# EasyEDA Pro project ProProject_工科大_2023-11-10.epro, board driver
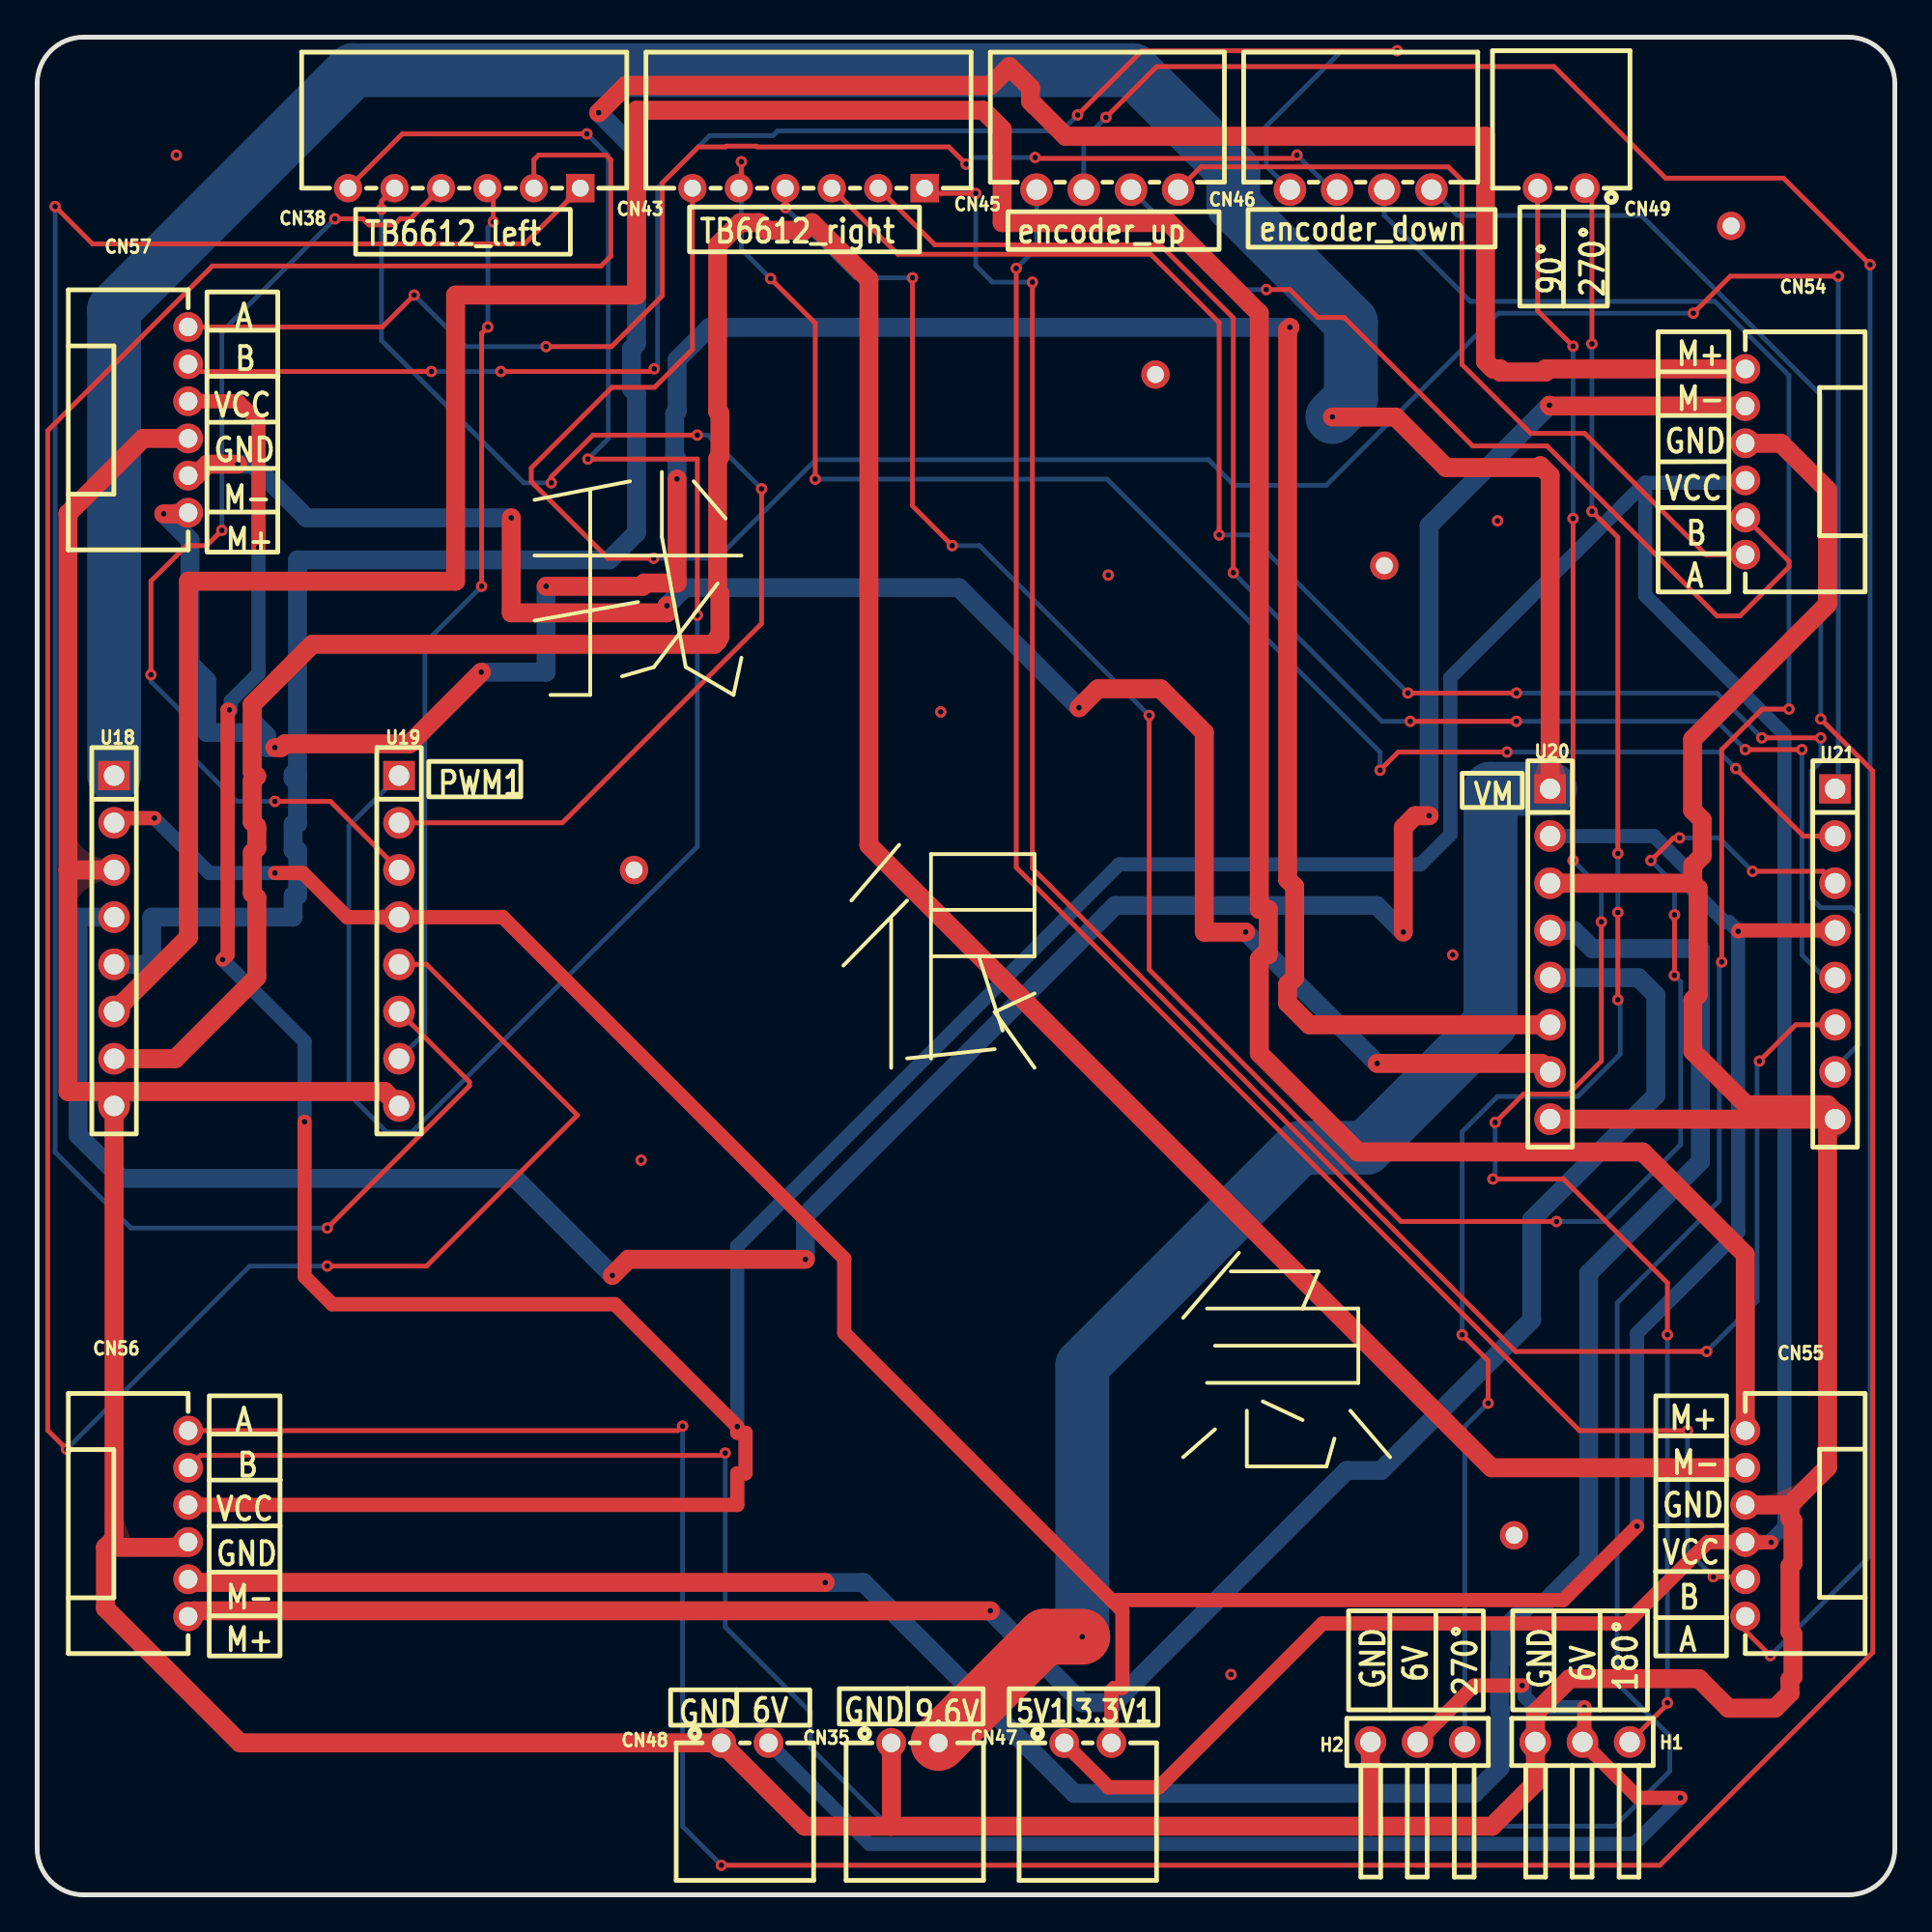
[diagram p5: board, top side]
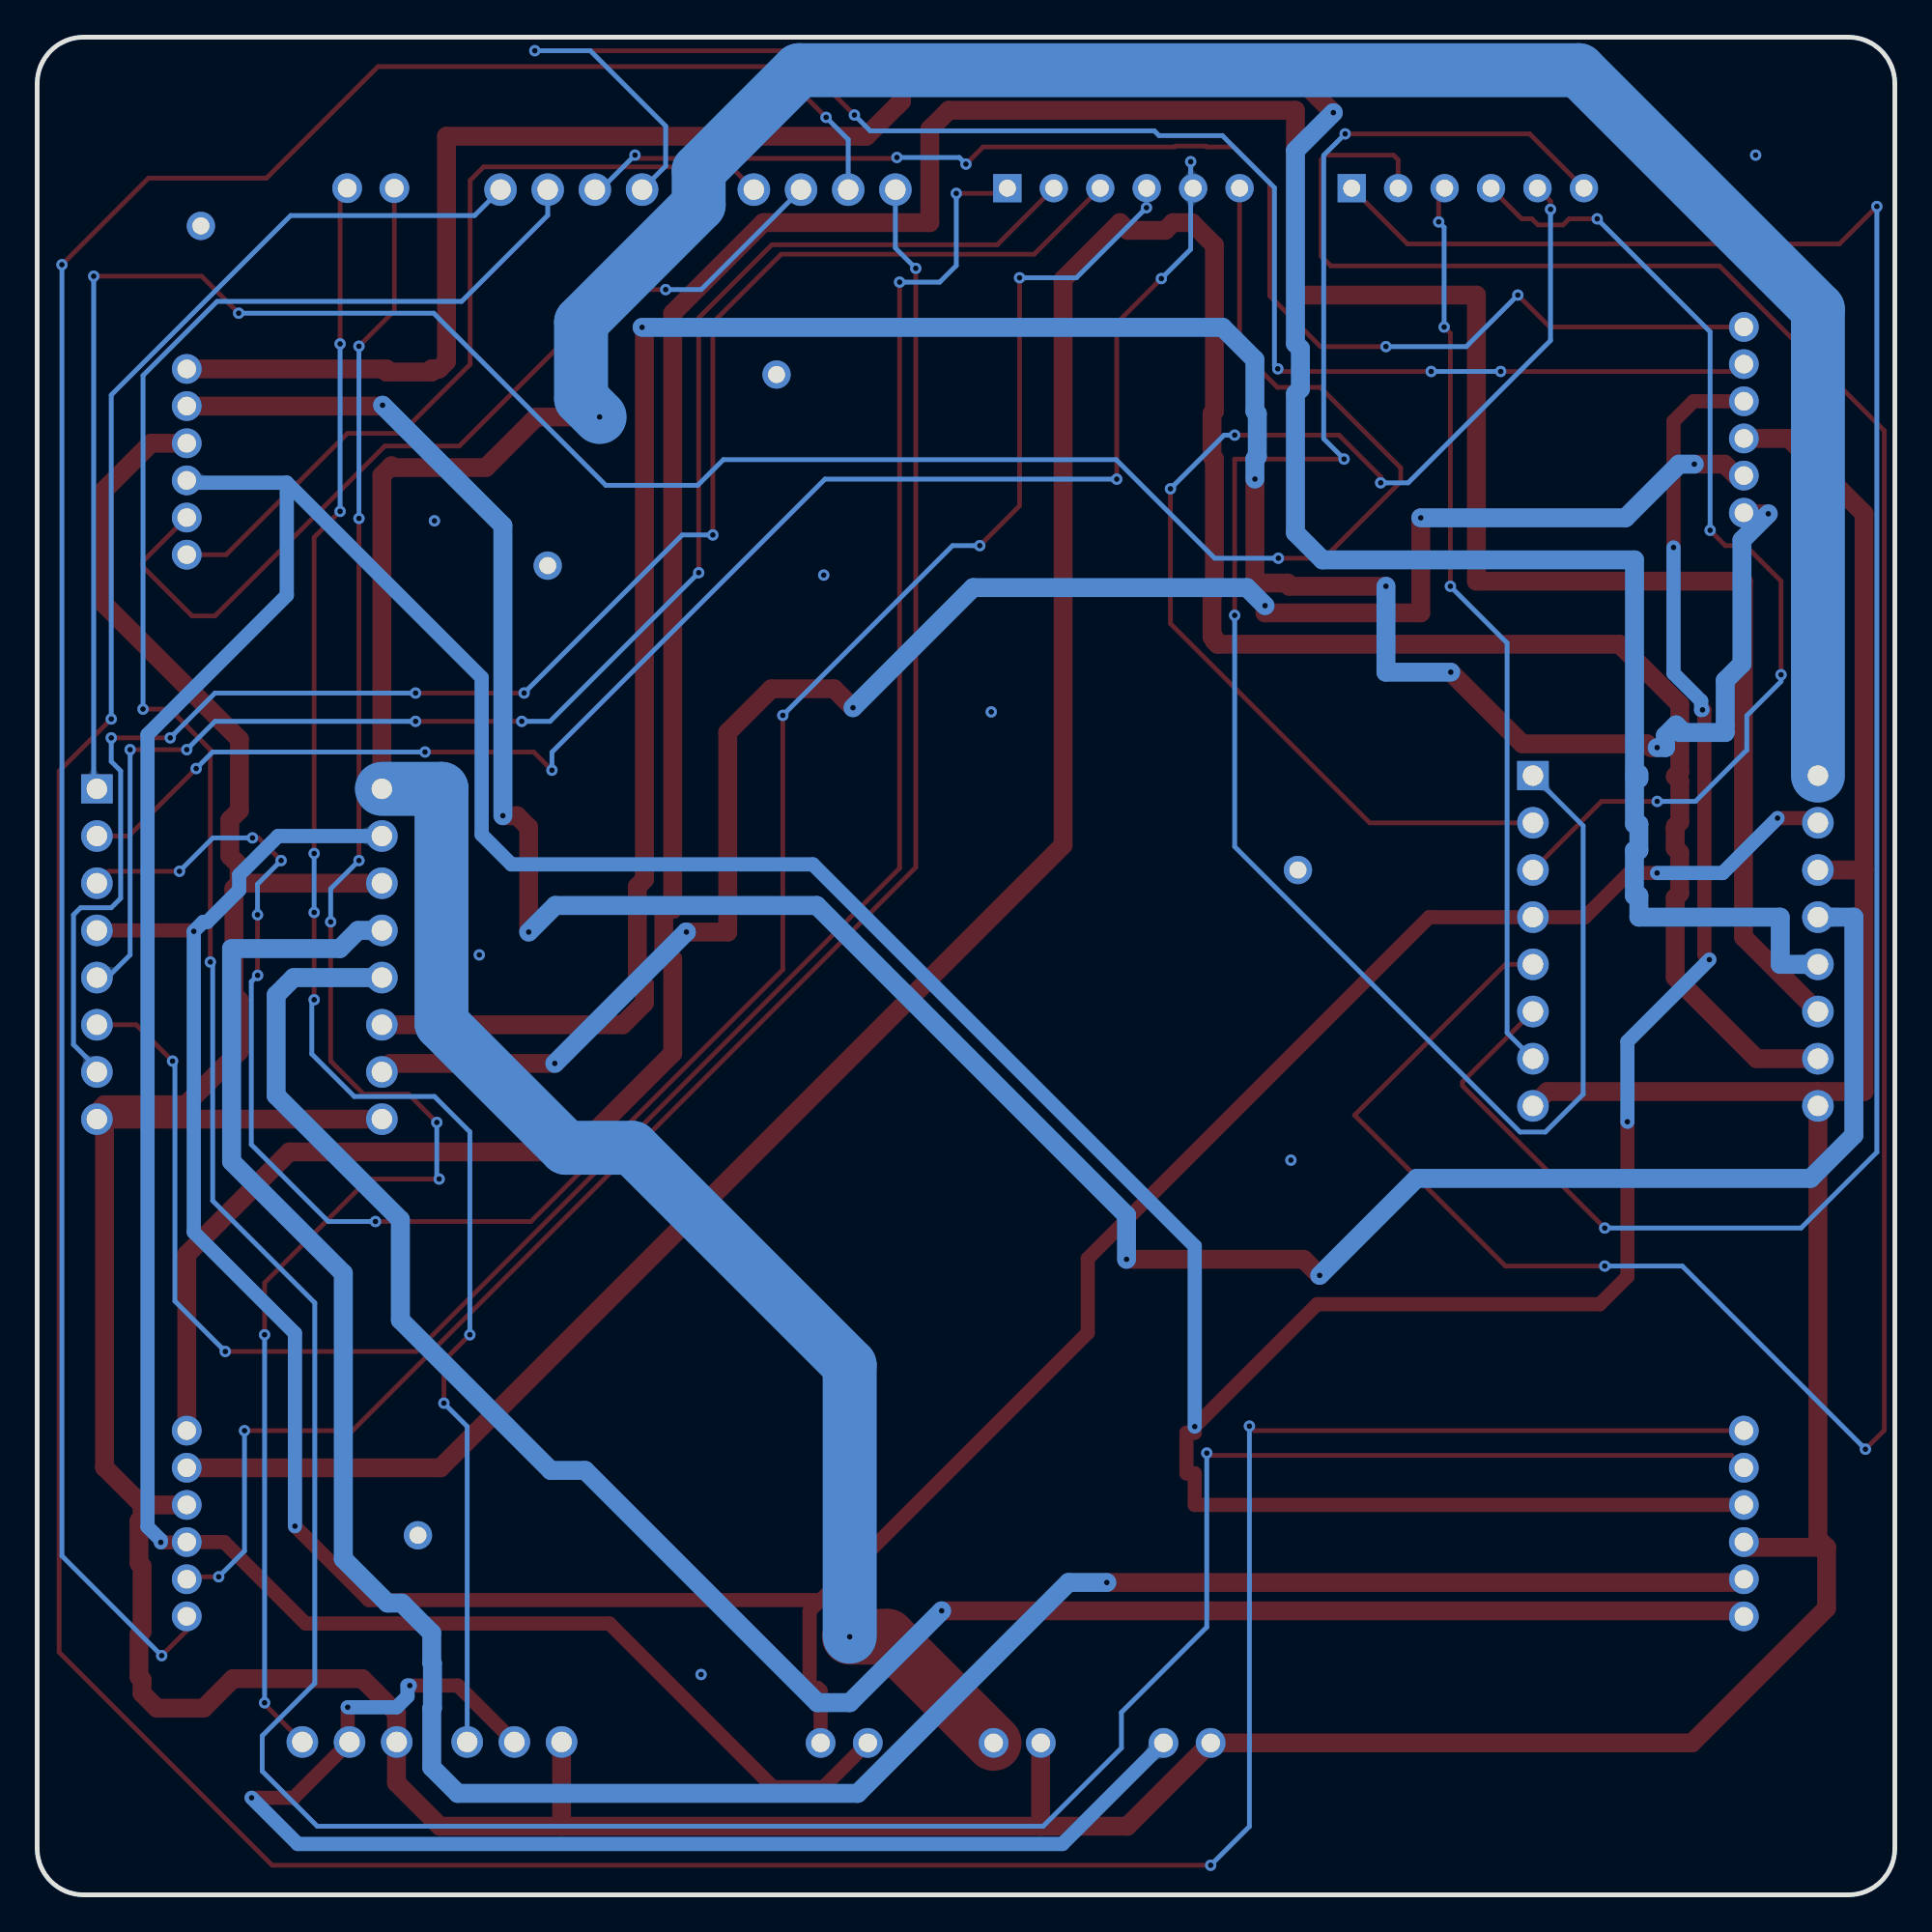
[diagram p6: board, bottom side, seen from below]

Outline 100 x 100 mm; copper layers: Top Layer, Bottom Layer. Coordinates in mm from the lower left corner of the outline.
Outline path: 0,97.5 0,2.5 arc(0.73,0.73) 2.5,0 97.5,0 arc(99.27,0.73) 100,2.5 100,97.5 arc(99.27,99.27) 97.5,100 2.5,100 arc(0.73,99.27) 0,97.5
Stack: Top Layer 0.035mm / Dielectric1 1.51mm FR4 er 4.5 / Bottom Layer 0.035mm

## Design rules (mm)
template: 自定义配置
spacing copperThickness1oz: track to track 0.102, other pairs 0.152 to 0.3
spacing copperThickness2oz (default): track to track 0.203, other pairs 0.203 to 0.203
spacing VCC和GND: track to track 0.762, other pairs 0.152 to 0.3
track width copperThickness1oz (default): min 0.254, default 0.254, max 3
track width copperThickness2oz: min 0.203, default 0.254, max 2.54
track width VCC AND GND: min 0.254, default 0.762, max 3
track width 9.6V: min 0.762, default 1.016, max 1.016
differential pair differentialPair (default): width min 0.127, default 0.254, max 2.54; gap min 0.152, default 0.152
via viaSize (default): diameter min 0.5, default 0.61, max 10; hole min 0.3, default 0.305, max 6.299
net GND uses 9.6V
net BO21 uses 9.6V
net BO22 uses 9.6V
net AO12 uses VCC AND GND
net AO11 uses VCC AND GND
net 3.3V1 uses VCC AND GND
net 9.6V uses VCC AND GND
net BO41 uses 9.6V
net BO42 uses 9.6V
net AO32 uses VCC AND GND
net AO31 uses VCC AND GND
net 5V1 uses VCC AND GND
net 6V uses VCC AND GND

## Placement (name value [footprint] x y rotation side)
CN35  9.6V  [CONN-TH_XH-2AW_C2908611]  47.24 8.18 0 top
CN38  TB6612 1  [CONN-TH_6P-P2.50_HC-XH-6AW-G]  22.99 91.87 180 top
CN43  TB6612 1  [CONN-TH_6P-P2.50_HC-XH-6AW-G]  41.52 91.87 180 top
CN45  编码器上  [CONN-TH_XH-4AW]  57.61 91.79 180 top
CN46  编码器下  [CONN-TH_XH-4AW]  71.25 91.79 180 top
CN47  XH-2AW  [CONN-TH_XH-2AW_C2908611]  56.56 8.18 0 top
CN48  6V  [CONN-TH_XH-2AW_C2908611]  38.1 8.18 0 top
CN49  SERVO  [CONN-TH_XH-2AW_C2908611]  82.04 91.87 180 top
CN54  电机1  [CONN-TH_6P-P2.00_HX20007-6WAP]  91.95 77.14 90 top
CN55  电机2  [CONN-TH_6P-P2.00_HX20007-6WAP]  91.95 19.99 90 top
CN56  电机3  [CONN-TH_6P-P2.00_HX20007-6WAP]  8.13 19.99 270 top
CN57  电机4  [CONN-TH_6P-P2.00_HX20007-6WAP]  8.13 79.4 270 top
H1  90°  [HDR-TH_3P-P2.54-H-M-BW7.2-P]  83.19 8.23 0 top
H2  270°  [HDR-TH_3P-P2.54-H-M-BW7.2-P]  74.31 8.23 0 top
NOREF  -  [Pad_e47191]  72.52 71.55 0 top
NOREF#2  -  [Pad_e47190]  60.2 81.84 0 top
NOREF#3  -  [Pad_e47189]  32.13 55.17 0 top
NOREF#4  -  [Pad_e47192]  91.19 89.84 0 top
NOREF#5  -  [Pad_e47193]  79.5 19.35 0 top
U18  TB6612 1  [HDR-TH_8P-P2.54-V-F]  4.14 51.36 270 top
U19  TB6612 1  [HDR-TH_8P-P2.54-V-F]  19.48 51.36 270 top
U20  TB6612 2  [HDR-TH_8P-P2.54-V-F]  81.44 50.65 270 top
U21  TB6612 2  [HDR-TH_8P-P2.54-V-F]  96.78 50.65 270 top

## Footprints (pads in the part's own frame, mm; a bottom-side part is the same pattern mirrored in y, then rotated)
CONN-TH_6P-P2.00_HX20007-6WAP
  round 1.6 hole 1: 1(-5,0) 2(-3,0) 3(-1,0) 4(1,0) 5(3,0) 6(5,0)
CONN-TH_6P-P2.50_HC-XH-6AW-G
  rect 1.524x1.524 hole 0.914: 1(-6.25,0)
  round 1.524 hole 0.914: 2(-3.75,0) 3(-1.25,0) 4(1.25,0) 5(3.75,0) 6(6.25,0)
CONN-TH_XH-2AW_C2908611
  round 1.6 hole 1: 1(-1.27,0) 2(1.27,0)
CONN-TH_XH-4AW
  round 1.75 hole 1.1: 1(-3.81,0) 2(-1.27,0) 3(1.27,0) 4(3.81,0)
HDR-TH_3P-P2.54-H-M-BW7.2-P
  round 1.7 hole 1.1: 1(-2.54,0) 2(0,0) 3(2.54,0)
HDR-TH_8P-P2.54-V-F
  rect 1.575x1.7 hole 1.1: 1(-8.89,0)
  round 1.7 hole 1.1: 2(-6.35,0) 3(-3.81,0) 4(-1.27,0) 5(1.27,0) 6(3.81,0) 7(6.35,0) 8(8.89,0)
Pad_e47189
  round 1.524 hole 0.914: 9(0,0)
Pad_e47190
  round 1.524 hole 0.914: 10(0,0)
Pad_e47191
  round 1.524 hole 0.914: 11(0,0)
Pad_e47192
  round 1.524 hole 0.914: 12(0,0)
Pad_e47193
  round 1.524 hole 0.914: 13(0,0)

## Nets
As in the schematic, except:
GND: CN35.1 CN48.1 CN54.4 CN55.4 CN56.4 CN57.4 H1.1 H2.1 NOREF.11 NOREF#2.10 NOREF#3.9 NOREF#4.12 NOREF#5.13 U18.3 U18.8 U19.8 U20.3 U20.8 U21.8

## Via types
v1: diameter 0.61, hole 0.305, Top Layer to Bottom Layer, 131 vias

## Routing (per net, layer and track width the routed paths; a pad name or vN(x,y) marks a point on that pad's centre or on a via; arc(x,y) is an arc through that point)
3.3V1: length 164.2
  Top Layer w0.762: v1(12.8,55.01) 14.31,55.01 16.68,52.63 U19.4 25.07,52.63 43.45,34.25 43.45,30.25 57.83,15.87 ; 57.83,15.87 58.42,15.28 58.42,11.14 57.98,11.14 57.83,10.98 CN47.2 ; 57.83,15.87 82.15,15.87 v1(86.12,19.84) ; v1(6.31,57.96) 4.39,57.96 U18.2 ; U21.4 91.62,51.92 v1(91.57,51.87)
  Bottom Layer w0.762: U20.2 87.03,57 89.13,54.9 89.13,54.09 90.84,52.37 91.06,52.37 v1(91.57,51.87) 91.57,35.67 86.12,30.23 v1(86.12,19.84) ; v1(12.8,55.01) 9.27,55.01 v1(6.31,57.96)
5V1: length 305.3
  Top Layer w0.762: CN57.3 10.84,80.4 11.91,79.32 v1(11.91,72.53) ; v1(9.98,50.34) 10.25,50.61 10.25,63.79 v1(10.35,63.79) ; v1(14.4,41.62) 14.4,33.28 15.88,31.79 31.1,31.79 v1(37.69,25.21) 37.69,24.87 38.13,24.87 38.13,22.69 37.69,22.69 37.69,20.99 CN56.3 ; v1(93.34,18.97) 91.96,18.97 CN55.3 89.93,18.99 85.55,14.61 69.19,14.61 60.38,5.79 57.67,5.79 CN47.1
  Bottom Layer w0.762: v1(93.34,18.97) 93.34,19.1 94.06,19.81 94.06,62.46 86.56,69.95 86.56,76.01 ; 86.56,76.01 76.07,65.53 76.07,57.07 74.47,55.47 58.24,55.47 37.69,34.92 v1(37.69,25.21) ; 86.56,76.01 91.82,76.01 CN54.3 ; v1(11.91,72.53) 11.91,65.75 10.43,64.27 10.43,63.79 v1(10.35,63.79) ; v1(9.98,50.34) 14.4,45.93 v1(14.4,41.62)
6V: length 71.9
  Top Layer w0.762: v1(79.94,11.27) 77.35,11.27 H2.2 ; v1(88.46,5.22) 86.19,5.22 H1.2 83.28,8.33 v1(83.28,10.1)
  Bottom Layer w0.762: CN48.2 44.81,2.74 85.97,2.74 v1(88.46,5.22) ; v1(79.94,11.27) 80.06,11.27 80.06,10.68 80.65,10.1 v1(83.28,10.1)
9.6V: length 209.3
  Top Layer w1.016: U20.1 81.44,76.41 80.92,76.93 80.83,76.83 75.84,76.83 73.12,79.55 v1(69.72,79.55)
  Top Layer w3: v1(56.26,13.89) 54.23,13.89 CN35.2
  Bottom Layer w2.9: U18.1 4.14,85.34 17.02,98.22 58.98,98.22 64.39,92.82 64.39,90.98 70.72,84.65 70.72,80.55 v1(69.72,79.55) ; U20.1 78.23,59.54 78.23,46.91 71.53,40.21 67.97,40.21 56.26,28.5 v1(56.26,13.89)
GND: length 310.1
  Top Layer w1.016: 1.66,55.17 1.66,43.24 4.14,43.24 ; 1.66,55.17 U18.3 ; 1.66,55.17 1.66,74.35 5.7,78.4 CN57.4 ; CN54.4 93.87,78.14 96.37,75.64 96.37,69.47 89.11,62.2 89.11,58.37 89.63,57.86 89.63,55.93 89.13,55.43 89.13,54.46 ; 3.68,18.71 3.68,15.43 10.92,8.18 CN48.1 41.32,3.69 45.99,3.69 ; 3.68,18.71 7.84,18.71 CN56.4 ; 3.68,18.71 4.14,19.17 U18.8 4.14,43.24 ; 71.77,3.69 H2.1 ; 71.77,3.69 45.99,3.69 ; 71.77,3.69 78.32,3.69 80.66,6.03 80.66,8.23 ; 96.37,42.53 96.37,41.76 ; 96.37,42.53 92,42.53 89.13,45.4 89.13,48.17 89.41,48.45 89.41,54.17 89.13,54.46 ; 96.37,42.53 96.78,42.12 U21.8 ; 96.37,41.76 U20.8 ; 96.37,41.76 96.37,23.01 94.35,20.99 ; 80.66,8.23 80.66,9.8 82.5,11.63 89.46,11.63 91.04,10.05 93.55,10.05 94.35,10.85 94.35,11.58 94.52,11.74 94.52,14.01 94.35,14.18 94.35,17.69 94.52,17.85 94.52,20.13 94.35,20.29 94.35,20.99 ; 80.66,8.23 H1.1 ; 45.99,3.69 45.99,8.17 CN35.1 ; 89.13,54.46 U20.3 ; 94.35,20.99 CN55.4 ; 4.14,43.24 18.71,43.24 U19.8
  vias: v1(7.49,93.65) v1(32.51,39.55) v1(48.64,63.68) v1(57.66,71.04) v1(64.26,11.86) v1(76.2,50.6) v1(78.61,73.97)
AO11: length 141
  Top Layer w1.016: v1(74.93,58.09) 74.17,58.09 73.54,57.46 v1(73.54,51.83) ; CN54.5 81.46,80.14 v1(81.41,80.19) ; v1(41.36,34.21) 31.83,34.21 v1(30.96,33.34)
  Bottom Layer w1.016: v1(73.54,51.83) 72.11,53.26 58.03,53.26 41.36,36.58 v1(41.36,34.21) ; v1(30.96,33.34) 25.74,38.57 4.54,38.57 2.2,40.9 2.2,52.63 U18.4 ; v1(81.41,80.19) 74.93,73.71 v1(74.93,58.09)
AO12: length 152.5
  Top Layer w1.016: v1(30.23,95.94) 31.69,97.4 51.32,97.4 52.33,98.41 53.47,97.28 53.47,96.55 53.7,96.32 53.7,96.32 55.36,94.67 77.96,94.67 77.96,82.54 78.36,82.14 78.76,82.14 78.76,81.97 81.2,81.97 81.2,82.14 CN54.6
  Bottom Layer w1.016: v1(30.23,95.94) 32.27,93.9 32.27,83.5 32,83.23 32,81.06 32.27,80.79 32.27,73.32 30.81,71.86 14.01,71.86 14.01,60.34 13.78,60.34 13.78,60.08 14.01,60.08 14.01,57.64 13.78,57.64 13.78,56.22 14.02,56.22 14.02,53.79 13.78,53.79 13.78,52.63 6.17,52.63 6.17,50.09 U18.5
AO31: length 133.5
  Top Layer w1.016: CN56.5 8.3,16.81 v1(42.42,16.81)
  Bottom Layer w1.016: v1(42.42,16.81) 44.48,16.81 55.83,5.46 77.36,5.46 78.76,6.86 78.76,10.03 78.72,10.07 78.72,12.47 78.76,12.5 78.76,14.1 80.37,15.71 81.14,15.71 83.52,18.08 83.52,33.46 89.53,39.48 89.53,50.94 83.71,50.94 82.73,51.92 U20.4
AO32: length 109.4
  Top Layer w1.016: v1(51.31,15.29) 8.43,15.29 CN56.6
  Bottom Layer w1.016: v1(51.31,15.29) 56.25,10.35 58,10.35 70.5,22.85 72.35,22.85 80.45,30.95 80.45,36.34 87.14,43.03 87.14,48.43 86.19,49.38 U20.5
BO21: length 174.5
  Top Layer w1.016: CN55.5 78.29,22.99 44.77,56.5 44.77,86.95 41.71,90.02 41.3,89.6 39.27,89.6 38.86,90.02 37.85,90.02 36.63,88.8 36.63,79.86 36.76,79.73 36.76,77.42 36.63,77.29 36.63,70.16 36.76,70.03 36.76,67.72 36.69,67.66 36.63,67.66 36.63,67.49 36.46,67.32 14.82,67.32 11.58,64.08 11.58,60.46 11.81,60.22 11.81,60.2 11.58,59.96 11.58,57.76 11.81,57.52 11.81,57.39 11.82,57.38 11.82,56.34 11.58,56.1 11.58,53.91 11.82,53.67 11.82,49.4 7.44,45.01 U18.7
BO22: length 196.1
  Top Layer w1.016: CN55.6 91.95,34.47 86.43,39.99 71.1,39.99 65.79,45.3 65.79,50.37 66.03,50.61 66.27,50.61 66.27,53.05 65.79,53.05 65.79,85.14 60.91,90.02 51.95,90.02 51.95,95.04 50.93,96.06 32.27,96.06 32.27,86.12 22.52,86.12 22.52,70.72 8.15,70.72 8.15,51.56 U18.6
BO41: length 98.6
  Top Layer w1.016: v1(56.08,63.9) 57.1,64.92 60.48,64.92 62.82,62.58 62.82,51.83 v1(65.05,51.83) ; U20.7 80.98,44.75 v1(72.14,44.75) ; v1(25.52,74.13) 25.52,69.01 33.9,69.01 v1(33.9,69.4) ; v1(10.8,77.01) 9.16,77.01 8.55,76.4 CN57.5
  Bottom Layer w1.016: v1(10.8,77.01) 11.61,77.01 14.5,74.13 v1(25.52,74.13) ; v1(65.05,51.83) 65.06,51.83 v1(72.14,44.75) ; v1(56.08,63.9) 49.62,70.37 34.87,70.37 v1(33.9,69.4)
BO42: length 144.2
  Top Layer w1.016: v1(6.81,74.34) 8.07,74.34 CN57.6 ; v1(12.8,61.76) 13.13,61.76 13.33,61.96 20.05,61.96 v1(23.91,65.82) ; U20.6 68.49,46.84 67.31,48.01 67.31,48.99 67.69,49.38 67.69,54.28 67.31,54.66 67.31,84.25 v1(67.44,84.38) ; v1(34.45,76.21) 34.45,70.62 32.68,70.62 32.68,70.53 32.59,70.44 v1(27.39,70.44)
  Bottom Layer w1.016: v1(34.45,76.21) 34.45,77.29 34.32,77.42 34.32,79.73 34.45,79.86 34.45,82.64 36.19,84.38 v1(67.44,84.38) ; v1(27.39,70.44) 27.39,65.82 v1(23.91,65.82) ; v1(12.8,61.76) 12.35,61.76 12.35,62.41 11.78,62.98 11.57,62.77 11.57,62.57 9.13,62.57 9.13,62.97 ; v1(6.81,74.34) 8.23,72.93 8.23,66.27 9.13,65.37 9.13,62.98
PA1: length 91.6
  Top Layer w0.254: v1(85.09,56.06) 85.09,73.08 v1(83.69,74.47) ; v1(85.09,48.18) v1(85.09,52.88) ; v1(83.69,83.49) 83.69,91.49 CN49.1 ; v1(76.71,30.15) 78.1,28.75 v1(78.1,26.47)
  Bottom Layer w0.254: v1(78.1,26.47) 76.85,25.21 H2.3 ; v1(83.69,74.47) v1(83.69,83.49) ; v1(85.09,52.88) v1(85.09,56.06) ; v1(85.09,48.18) 85.22,48.06 85.22,45.26 82.93,42.98 78.61,42.98 76.71,41.07 v1(76.71,30.15)
PA2: length 95.9
  Top Layer w0.254: v1(87.76,30.15) 87.76,32.94 82.17,38.53 v1(78.36,38.53) ; H1.3 87.76,10.26 v1(87.76,10.34) ; v1(82.68,83.36) 80.77,85.27 CN49.2 ; v1(82.68,74.09) v1(82.68,55.68) ; v1(84.2,52.38) 84.2,44.88 82.42,43.1 80.01,43.1 v1(78.49,41.58)
  Bottom Layer w0.254: v1(84.2,52.38) 84.2,54.15 v1(82.68,55.68) ; v1(82.68,83.36) v1(82.68,74.09) ; v1(87.76,10.34) v1(87.76,30.15) ; v1(78.36,38.53) 78.49,38.66 v1(78.49,41.58)
PA7: length 49.1
  Top Layer w0.254: v1(24.26,84.4) 23.93,84.06 v1(23.93,70.44) ; v1(24.55,90.06) 24.55,91.55 CN38.3
  Bottom Layer w0.254: v1(24.55,90.06) 24.26,89.76 v1(24.26,84.4) ; U19.7 20.87,46.4 20.87,67.39 v1(23.93,70.44)
PA8: length 45.5
  Top Layer w0.254: CN54.1 89.83,72.14 83.29,78.67 80.4,78.67 76.69,82.38 76.69,92.29 75.97,93.02 62.64,93.02 CN45.1
PA15: length 212.3
  Top Layer w0.254: v1(96.01,63.3) 98.82,60.49 98.82,13.06 87.35,1.59 v1(36.83,1.59) ; CN56.1 34.5,24.99 v1(34.74,25.23)
  Bottom Layer w0.254: 75.06,91.79 76.45,90.4 86.35,90.4 96.01,80.74 v1(96.01,63.3) ; v1(34.74,25.23) 34.74,3.68 v1(36.83,1.59)
PB3: length 204
  Top Layer w0.254: v1(94.3,63.83) 92.86,63.83 90.68,61.65 v1(90.68,50.22) ; v1(37.04,23.78) 36.91,23.65 8.79,23.65 CN56.2
  Bottom Layer w0.254: v1(37.04,23.78) 37.04,14.41 41.63,9.82 41.63,7.91 45.85,3.69 84.92,3.69 87.88,6.66 87.88,8.56 85.05,11.39 85.05,31.87 90.55,37.36 90.55,50.09 v1(90.68,50.22) ; v1(94.3,63.83) 94.3,81.79 90.31,85.78 77.15,85.78 72.52,90.41 72.52,91.79
PB6: length 73.2
  Top Layer w0.254: v1(53.72,93.52) 53.77,93.47 67.64,93.47 v1(67.82,93.65) ; v1(27.39,83.34) 30.91,83.34 33.65,86.08 33.65,92.16 35.59,94.09 37.05,94.09 37.09,94.14 38.72,94.14 38.77,94.09 49.08,94.09 v1(50,93.17) ; CN57.1 18.58,84.4 v1(20.3,86.12)
  Bottom Layer w0.254: CN46.3 69.68,91.79 v1(67.82,93.65) ; v1(20.3,86.12) 23.07,83.34 v1(27.39,83.34) ; v1(53.72,93.52) 50.36,93.52 v1(50,93.17)
PB7: length 90.7
  Top Layer w0.254: v1(33.22,82.15) 33.07,82 v1(24.96,82) ; v1(56.01,95.81) 59.47,99.27 v1(73.21,99.27) ; v1(21.22,82) 8.52,82 CN57.2
  Bottom Layer w0.254: v1(56.01,95.81) 55.15,94.96 39.86,94.96 39.61,94.7 36.2,94.7 33.4,91.9 33.4,82.33 v1(33.22,82.15) ; v1(73.21,99.27) 70.23,99.27 66.17,95.21 66.17,93.06 CN46.4 ; v1(24.96,82) v1(21.22,82)
PC0: length 54.9
  Top Layer w0.254: v1(9.94,73.45) 9.12,72.63 8.04,72.63 6.13,70.72 v1(6.13,65.68) ; v1(12.8,58.86) 15.79,58.86 U19.3 ; CN38.4 20.09,90.22 19.54,90.22 19.21,89.89 17.86,89.89 17.53,90.22 v1(16.03,90.22)
  Bottom Layer w0.254: v1(6.13,65.68) 6.13,65.32 7.97,63.47 7.97,61.63 10.74,58.86 v1(12.8,58.86) ; v1(16.03,90.22) 9.94,84.14 v1(9.94,73.45)
PC1: length 65.8
  Top Layer w0.254: CN38.5 18.54,91.17 v1(18.54,90.73) ; v1(39,75.69) 39,68.43 28.27,57.71 U19.2 ; v1(27.68,76.01) 27.68,76.33 29.92,78.58 v1(35.54,78.58)
  Bottom Layer w0.254: v1(18.54,90.73) 18.54,83.67 26.2,76.01 v1(27.68,76.01) ; v1(35.54,78.58) 36.11,78.58 v1(39,75.69)
PC2: length 148.4
  Top Layer w0.254: CN38.2 26.74,93.4 26.99,93.65 30.62,93.65 30.88,93.4 30.88,88.21 30.36,87.68 9.44,87.68 0.57,78.82 0.57,25 v1(1.58,23.99) ; v1(15.62,33.85) 20.96,33.85 29.08,41.97 20.96,50.09 U19.5
  Bottom Layer w0.254: v1(1.58,23.99) 11.44,33.85 v1(15.62,33.85)
PC3: length 114
  Top Layer w0.254: v1(0.97,90.89) 2.98,88.87 26.23,88.87 CN38.1 ; U19.6 23.27,43.76 23.27,43.55 v1(15.62,35.89)
  Bottom Layer w0.254: v1(15.62,35.89) 5.05,35.89 0.97,39.98 v1(0.97,90.89)
PC4: length 116.2
  Top Layer w0.254: v1(88.13,49.5) 88.14,49.5 v1(88.14,52.76) ; CN43.4 40.28,91.86 v1(40.28,90.82) ; v1(59.86,63.49) 59.86,49.8 73.42,36.25 v1(81.79,36.25) ; v1(49.26,72.63) 47.12,74.77 v1(47.12,87.05) ; v1(88.41,56.9) 88.09,56.9 v1(86.87,55.68) ; U21.3 96.14,55.1 v1(92.34,55.1)
  Bottom Layer w0.254: v1(88.14,52.76) 88.14,54.41 v1(86.87,55.68) ; v1(81.79,36.25) 84.33,36.25 88.47,40.39 88.47,49.15 v1(88.13,49.5) ; v1(88.41,56.9) 90.54,56.9 v1(92.34,55.1) ; v1(47.12,87.05) 44.06,87.05 v1(40.28,90.82) ; v1(59.86,63.49) 50.72,72.63 v1(49.26,72.63)
PC5: length 84.5
  Top Layer w0.254: U21.2 95.07,57 v1(91.44,60.63) ; v1(41.88,76.21) 41.88,84.6 v1(39.48,87) ; v1(72.29,60.54) 73.27,61.52 v1(79.12,61.52) ; CN43.5 37.91,92 v1(37.91,93.3)
  Bottom Layer w0.254: v1(91.44,60.63) 90.55,61.52 v1(79.12,61.52) ; v1(37.91,93.3) 37.91,88.58 v1(39.48,87) ; v1(72.29,60.54) 72.29,61.51 57.59,76.21 v1(41.88,76.21)
PC6: length 234.3
  Top Layer w0.254: v1(29.59,94.79) 19.66,94.79 CN38.6 ; v1(35.54,68.88) 35.54,77.29 v1(29.65,77.29) ; v1(98.67,87.75) 94.01,92.41 87.66,92.41 81.65,98.42 60.26,98.42 v1(57.53,95.68) ; CN55.1 91.95,14.22 v1(93.3,12.88)
  Bottom Layer w0.254: v1(57.53,95.68) 56.34,94.49 CN45.3 ; v1(93.3,12.88) 98.67,18.25 v1(98.67,87.75) ; U19.1 16.78,57.55 16.78,43.09 18.81,41.06 20.17,41.06 35.54,56.43 v1(35.54,68.88) ; v1(29.65,77.29) 30.74,78.38 30.74,93.64 v1(29.59,94.79)
PC7: length 95.8
  Top Layer w0.254: CN55.2 91.82,17.12 v1(90.23,17.12) ; v1(52.71,87.55) 52.71,55.31 83.02,24.99 v1(88.84,24.99)
  Bottom Layer w0.254: CN45.4 53.8,88.65 v1(52.71,87.55) ; v1(88.84,24.99) 88.84,18.51 v1(90.23,17.12)
PC8: length 127.9
  Top Layer w0.254: CN43.6 35.27,83.19 33.24,81.15 30.94,81.15 26.6,76.81 26.6,76.07 30.72,71.95 v1(33.19,71.95) ; v1(96.96,87.13) 91.15,87.13 v1(89.15,85.14)
  Bottom Layer w0.254: U21.1 96.96,59.71 v1(96.96,87.13) ; v1(89.15,85.14) 78.66,85.14 69.39,75.88 64.44,75.88 63.06,77.26 41.92,77.26 36.61,71.95 v1(33.19,71.95)
PC9: length 92.9
  Top Layer w0.254: CN43.3 46.33,88.32 59.94,88.32 63.63,84.63 v1(63.63,73.2) ; v1(73.79,64.69) v1(79.63,64.69) ; v1(96.01,62.28) v1(92.84,62.28)
  Bottom Layer w0.254: v1(79.63,64.69) 90.42,64.69 v1(92.84,62.28) ; v1(63.63,73.2) 65.28,73.2 v1(73.79,64.69) ; v1(96.01,62.28) 96.01,61.01 95.5,60.5 95.5,53.64 96.01,53.14 97.66,53.14 98.04,52.76 98.04,45.77 96.78,44.51 U21.7
PC10: length 83.6
  Top Layer w0.254: v1(95,61.65) v1(91.95,61.65) ; v1(73.91,63.17) v1(79.63,63.17) ; CN43.2 48.32,88.82 60.45,88.82 64.39,84.89 v1(64.39,71.17)
  Bottom Layer w0.254: v1(95,61.65) 95,50.6 96.22,49.38 U21.5 ; v1(64.39,71.17) 72.39,63.17 v1(73.91,63.17) ; v1(79.63,63.17) 90.42,63.17 v1(91.95,61.65)
PC11: length 110.5
  Top Layer w0.254: CN43.1 48.05,91.59 v1(50.52,91.59) ; v1(89.87,29.25) 79.59,29.25 53.57,55.26 v1(53.57,86.81) ; U21.6 94.66,46.84 v1(92.71,44.88)
  Bottom Layer w0.254: v1(53.57,86.81) 51.41,86.81 50.52,87.7 v1(50.52,91.59) ; v1(89.87,29.25) 92.58,31.96 92.58,44.75 v1(92.71,44.88)
PE11: length 49.7
  Top Layer w0.254: CN54.2 94.31,71.78 94.31,71.49 91.66,68.84 90.43,68.84 81.28,77.99 77.28,77.99 70.36,84.91 68.94,84.91 67.44,86.41 v1(66.17,86.41)
  Bottom Layer w0.254: v1(66.17,86.41) 64.26,86.41 CN45.2

## Copper pours and planes (outline as drawn; the poured copper is in the pictures)
GND on Top Layer: 0,99.37 101.85,99.37 101.85,-0.84 0,-0.84
GND on Bottom Layer: 0,99.75 101.6,99.75 101.6,-1.09 0,-1.09

Small or netless copper shapes (teardrops, artwork), in the pictures only: 111 on Top Layer, 61 on Bottom Layer

## Text on the board
Top Silkscreen Layer: 5V1 | 3.3V1 | PWM1 | GND | 6V | 9.6V | VM | 270° | 180° | VCC | M- | M+ | A | B | TB6612_left | TB6612_right | encoder_up | encoder_down | 90° | 我 | 很 | 急
